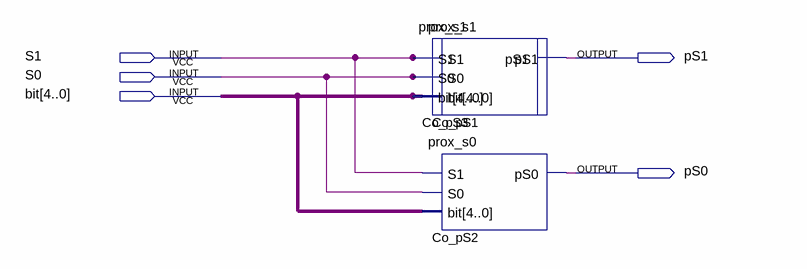
[diagram p0: schematic sheet]
// Quartus schematic teste_estados.bdf as structural Verilog: 3 symbols, 5 pins
module teste_estados (
  input  S1,
  input  S0,
  input  [4:0] \bit ,
  output pS1,
  output pS0
);

  prox_s1 Co_pS1 (.S1(S1), .S0(S0), .\bit (\bit ), .pS1(pS1));
  prox_s1 Co_pS3 (.S1(S1), .S0(S0), .\bit (\bit ));  // open: pS1
  prox_s0 Co_pS2 (.S1(S1), .S0(S0), .\bit (\bit ), .pS0(pS0));
endmodule
